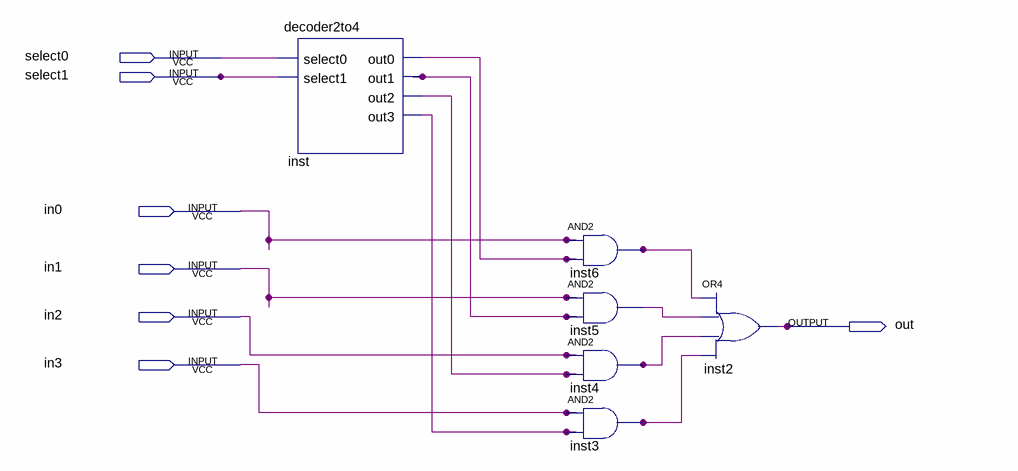
[diagram p0: schematic sheet]
// Quartus schematic mux4to1 (2).bdf as structural Verilog: 6 symbols, 7 pins
module \mux4to1_(2)  (
  input  select0,
  input  select1,
  input  in0,
  input  in1,
  input  in2,
  input  in3,
  output out
);

  wire inst3_out, inst4_out, inst5_out, inst6_out, inst_out0, inst_out1, inst_out2, inst_out3;

  decoder2to4 inst (
    .select0(select0), .select1(select1), .out0(inst_out0), .out1(inst_out1), .out2(inst_out2),
    .out3(inst_out3));
  and inst6 (inst6_out, in0, inst_out0);
  and inst5 (inst5_out, in1, inst_out1);
  and inst4 (inst4_out, in2, inst_out2);
  and inst3 (inst3_out, in3, inst_out3);
  or inst2 (out, inst6_out, inst5_out, inst4_out, inst3_out);
endmodule
